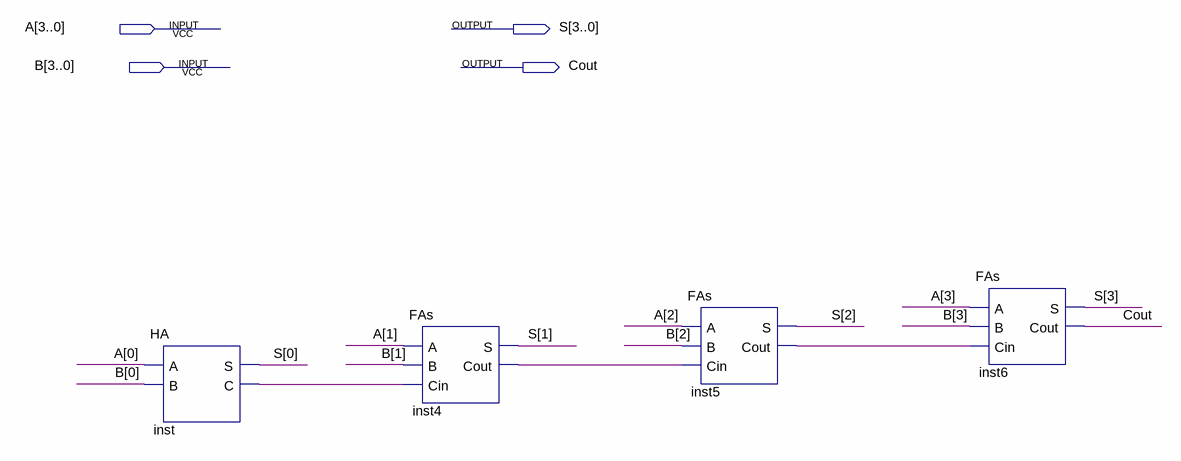
[diagram p0: schematic sheet]
// Quartus schematic RCA.bdf as structural Verilog: 4 symbols, 4 pins
module RCA (
  input  [3:0] A,
  input  [3:0] B,
  output [3:0] S,
  output Cout
);

  wire inst4_cout, inst5_cout, inst_c;

  HA inst (.A(A[0]), .B(B[0]), .S(S[0]), .C(inst_c));
  FAs inst4 (.A(A[1]), .B(B[1]), .Cin(inst_c), .S(S[1]), .Cout(inst4_cout));
  FAs inst5 (.A(A[2]), .B(B[2]), .Cin(inst4_cout), .S(S[2]), .Cout(inst5_cout));
  FAs inst6 (.A(A[3]), .B(B[3]), .Cin(inst5_cout), .S(S[3]), .Cout(Cout));
endmodule
